# Altium schematic sheet CONNECTOR.SchDoc
size Letter; SheetNumber: 1; SheetTotal: 2
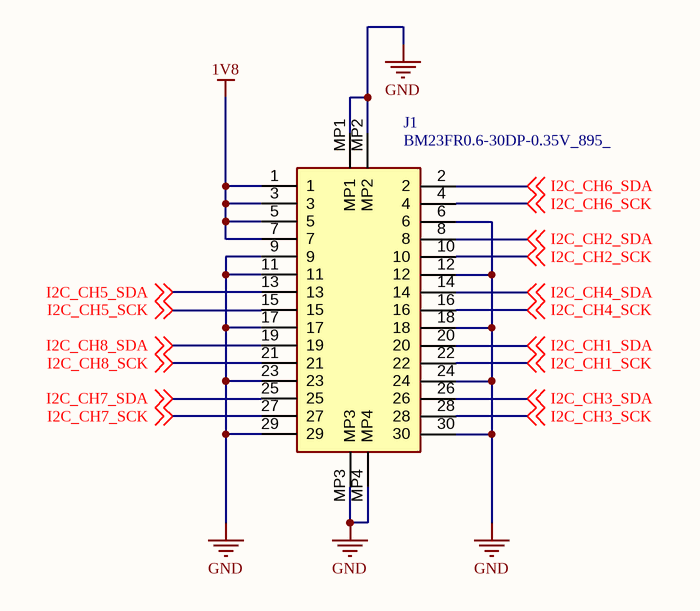
[diagram p0: CONNECTOR.SchDoc]

## Parts
J1  BM23FR0.6-30DP-0.35V_895_  [BM23FR0630DP035V895]

## Nets
1V8: J1.1 J1.3 J1.5 J1.7
GND: J1.6 J1.9 J1.11 J1.12 J1.17 J1.18 J1.23 J1.24 J1.29 J1.30 J1.MP1 J1.MP2 J1.MP3 J1.MP4
I2C_CH1_SCK: J1.22 ; off-sheet I2C_CH1_SCK
I2C_CH1_SDA: J1.20 ; off-sheet I2C_CH1_SDA
I2C_CH2_SCK: J1.10 ; off-sheet I2C_CH2_SCK
I2C_CH2_SDA: J1.8 ; off-sheet I2C_CH2_SDA
I2C_CH3_SCK: J1.28 ; off-sheet I2C_CH3_SCK
I2C_CH3_SDA: J1.26 ; off-sheet I2C_CH3_SDA
I2C_CH4_SCK: J1.16 ; off-sheet I2C_CH4_SCK
I2C_CH4_SDA: J1.14 ; off-sheet I2C_CH4_SDA
I2C_CH5_SCK: J1.15 ; off-sheet I2C_CH5_SCK
I2C_CH5_SDA: J1.13 ; off-sheet I2C_CH5_SDA
I2C_CH6_SCK: J1.4 ; off-sheet I2C_CH6_SCK
I2C_CH6_SDA: J1.2 ; off-sheet I2C_CH6_SDA
I2C_CH7_SCK: J1.27 ; off-sheet I2C_CH7_SCK
I2C_CH7_SDA: J1.25 ; off-sheet I2C_CH7_SDA
I2C_CH8_SCK: J1.21 ; off-sheet I2C_CH8_SCK
I2C_CH8_SDA: J1.19 ; off-sheet I2C_CH8_SDA

## Notes on the sheet
- Title
- Copyright (c) Meta Platforms, Inc. and affiliates.
  All rights reserved.
  This source code is licensed under the license found in the
  LICENSE file in the root directory of this source tree.
- Sheet
- of

## Library data of the parts
J1 = BM23FR0.6-30DP-0.35V_895_: Connector; Manufacturer_Name: Hirose; Manufacturer_Part_Number: BM23FR0.6-30DP-0.35V(895); Datasheet Link: https://www.hirose.com/product/document?clcode=CL0480-0325-0-95&productname=BM23FR0.6-30DP-0.35V(895)&series=BM23FR&documenttype=2DDrawing&lang=en&documentid=D164575_en; Height: 0.615mm; Mouser Part Number: 798-3FR0630DP035V895; Mouser Price/Stock: https://www.mouser.co.uk/ProductDetail/Hirose-Connector/BM23FR0.6-30DP-0.35V895?qs=YCa%2FAAYMW00qhFyDlbncMA%3D%3D